# Altium schematic sheet top_overview.SchDoc
size B; SheetNumber: 1; SheetTotal: 3
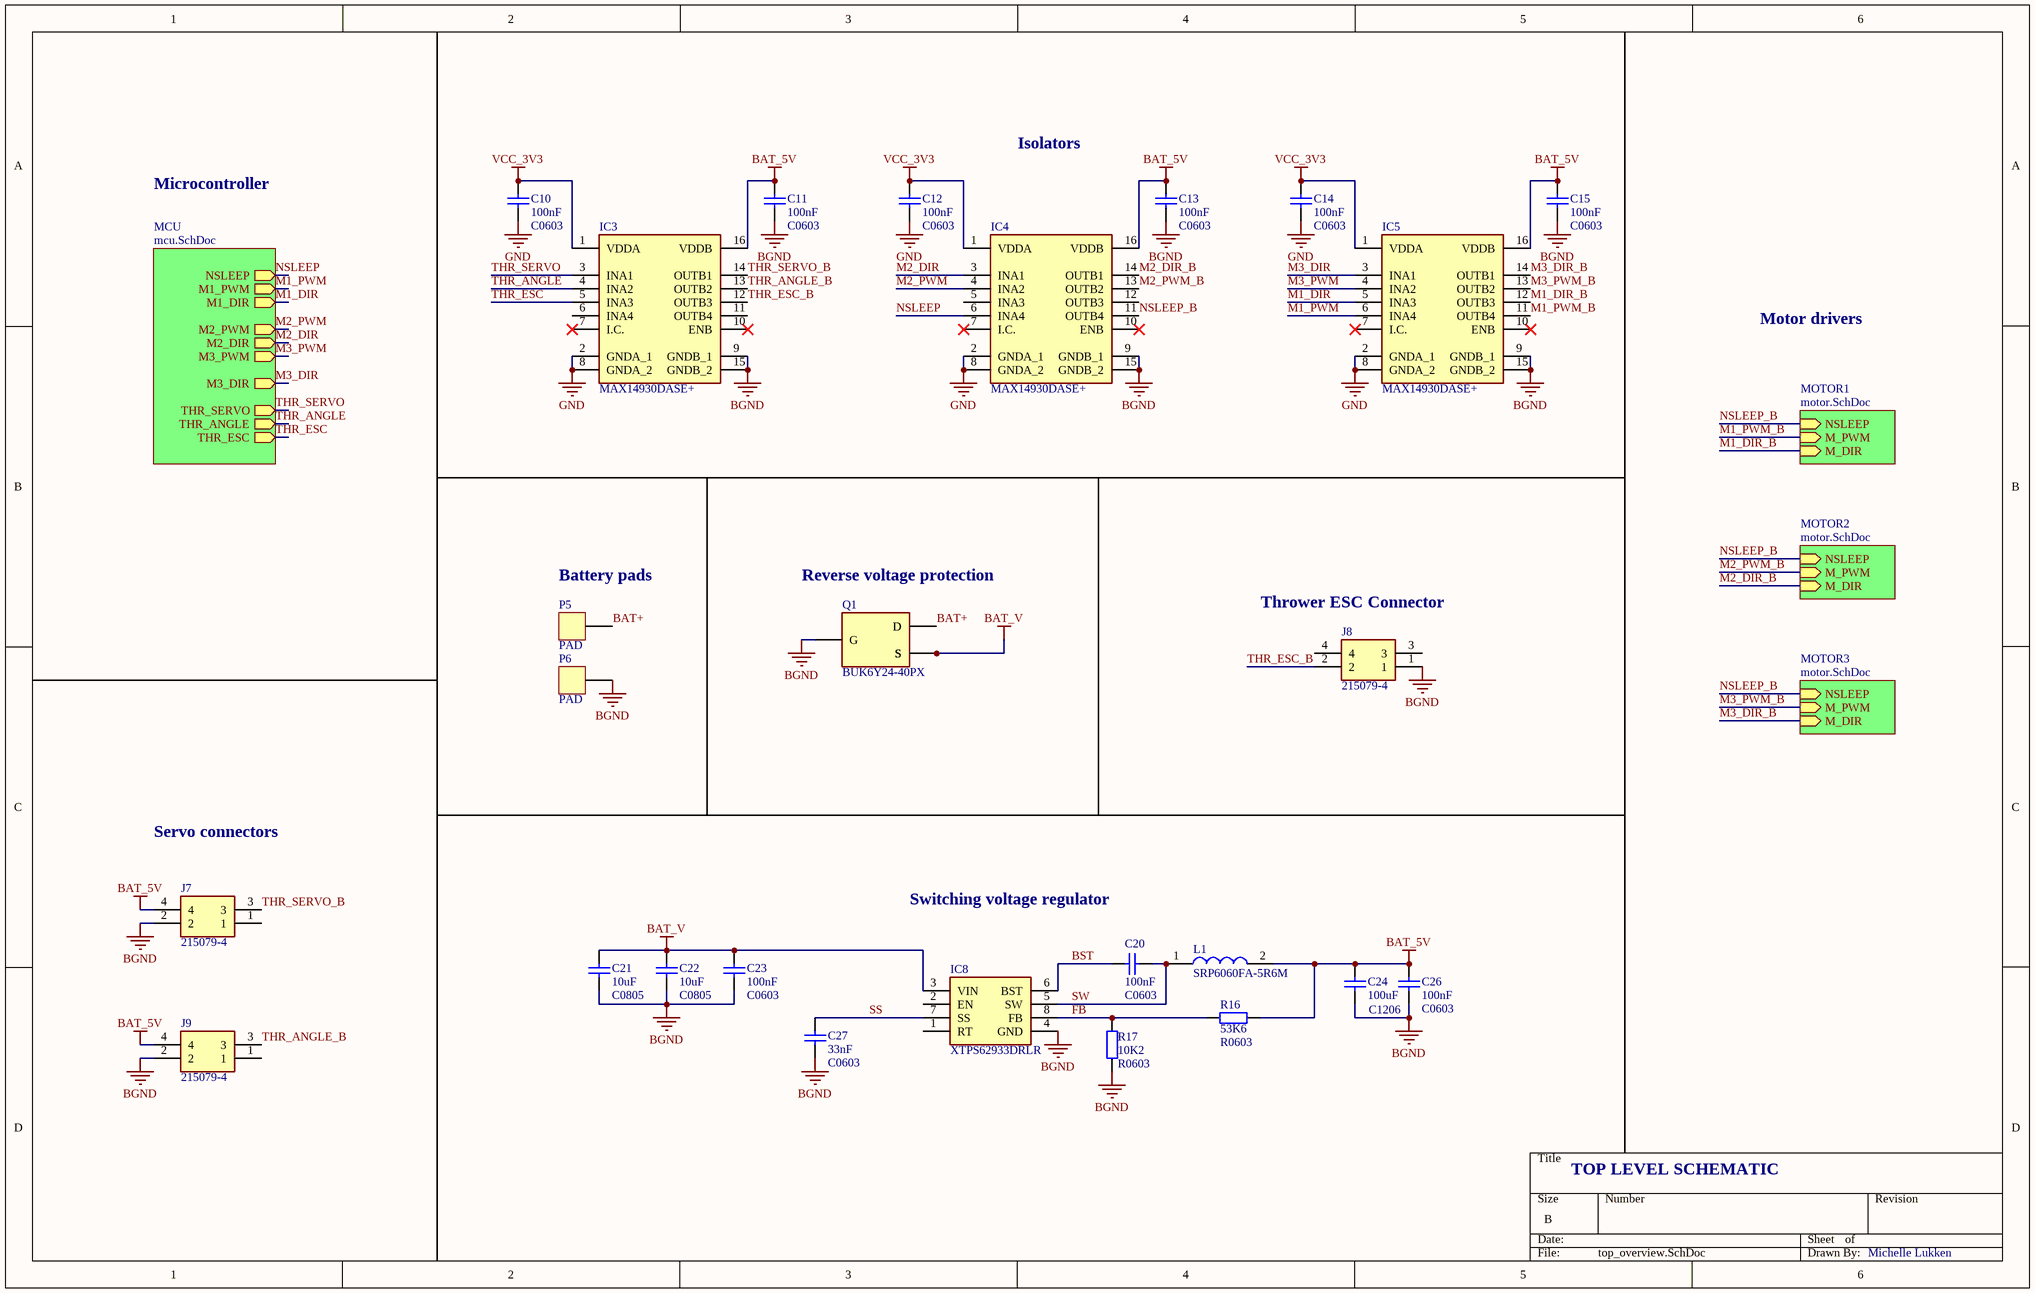
[diagram p0: top_overview.SchDoc]

## Parts
C10  Capacitance: 100nF  [C0603]
C11  Capacitance: 100nF  [C0603]
C12  Capacitance: 100nF  [C0603]
C13  Capacitance: 100nF  [C0603]
C14  Capacitance: 100nF  [C0603]
C15  Capacitance: 100nF  [C0603]
C20  Capacitance: 100nF  [C0603]
C21  Capacitance: 10uF  [C0805]
C22  Capacitance: 10uF  [C0805]
C23  Capacitance: 100nF  [C0603]
C24  Capacitance: 100uF  [C1206]
C26  Capacitance: 100nF  [C0603]
C27  Capacitance: 33nF  [C0603]
IC3  MAX14930DASE+  [SOIC127P600X175-16N]
IC4  MAX14930DASE+  [SOIC127P600X175-16N]
IC5  MAX14930DASE+  [SOIC127P600X175-16N]
IC8  XTPS62933DRLR  [SOTFL50P160X60-8N]
J7  215079-4  [2150794]
J8  215079-4  [2150794]
J9  215079-4  [2150794]
L1  SRP6060FA-5R6M  [SRP6060FA5R6M]
P5  PAD  [BIG_PAD]
P6  PAD  [BIG_PAD]
Q1  BUK6Y24-40PX  [BUK6Y2440PX]
R16  53K6  [R0603]
R17  10K2  [R0603]

## Sub-sheets
MCU = mcu.SchDoc: M2_DIR (out), M3_PWM (out), M1_PWM (out), M2_PWM (out), M3_DIR (out), M1_DIR (out), NSLEEP (out), THR_SERVO (out), THR_ANGLE (out), THR_ESC (out)
MOTOR1 = motor.SchDoc: NSLEEP (in), M_PWM (in), M_DIR (in)
MOTOR2 = motor.SchDoc: NSLEEP (in), M_PWM (in), M_DIR (in)
MOTOR3 = motor.SchDoc: NSLEEP (in), M_PWM (in), M_DIR (in)

## Nets
BAT_5V: C11.2 C13.2 C15.2 C24.1 C26.1 IC3.16(VDDB) IC4.16(VDDB) IC5.16(VDDB) J7.4 J9.4 L1.2 R16.2
BAT_V: C21.2 C22.2 C23.2 IC8.3(VIN) Q1.1(S) Q1.2(S) Q1.3(S)
BGND: C11.1 C13.1 C15.1 C21.1 C22.1 C23.1 C24.2 C26.2 C27.1 IC3.9(GNDB_1) IC3.15(GNDB_2) IC4.9(GNDB_1) IC4.15(GNDB_2) IC5.9(GNDB_1) IC5.15(GNDB_2) IC8.4(GND) J7.2 J8.1 J9.2 P6.1(PAD) Q1.4(G) R17.2
GND: C10.1 C12.1 C14.1 IC3.2(GNDA_1) IC3.8(GNDA_2) IC4.2(GNDA_1) IC4.8(GNDA_2) IC5.2(GNDA_1) IC5.8(GNDA_2)
VCC_3V3: C10.2 C12.2 C14.2 IC3.1(VDDA) IC4.1(VDDA) IC5.1(VDDA)
BAT+: P5.1(PAD) Q1.5(D) Q1.6(D)
BST: C20.2 IC8.6(BST)
FB: IC8.8(FB) R16.1 R17.1
M1_DIR: IC5.5(INA3) ; sheet MCU/M1_DIR
M1_DIR_B: IC5.12(OUTB3) ; sheet MOTOR1/M_DIR
M1_PWM: IC5.6(INA4) ; sheet MCU/M1_PWM
M1_PWM_B: IC5.11(OUTB4) ; sheet MOTOR1/M_PWM
M2_DIR: IC4.3(INA1) ; sheet MCU/M2_DIR
M2_DIR_B: IC4.14(OUTB1) ; sheet MOTOR2/M_DIR
M2_PWM: IC4.4(INA2) ; sheet MCU/M2_PWM
M2_PWM_B: IC4.13(OUTB2) ; sheet MOTOR2/M_PWM
M3_DIR: IC5.3(INA1) ; sheet MCU/M3_DIR
M3_DIR_B: IC5.14(OUTB1) ; sheet MOTOR3/M_DIR
M3_PWM: IC5.4(INA2) ; sheet MCU/M3_PWM
M3_PWM_B: IC5.13(OUTB2) ; sheet MOTOR3/M_PWM
NSLEEP: IC4.6(INA4) ; sheet MCU/NSLEEP
NSLEEP_B: IC4.11(OUTB4) ; sheet MOTOR1/NSLEEP, sheet MOTOR2/NSLEEP, sheet MOTOR3/NSLEEP
SS: C27.2 IC8.7(SS)
SW: C20.1 IC8.5(SW) L1.1
THR_ANGLE: IC3.4(INA2) ; sheet MCU/THR_ANGLE
THR_ANGLE_B: IC3.13(OUTB2) J9.3
THR_ESC: IC3.5(INA3) ; sheet MCU/THR_ESC
THR_ESC_B: IC3.12(OUTB3) J8.2
THR_SERVO: IC3.3(INA1) ; sheet MCU/THR_SERVO
THR_SERVO_B: IC3.14(OUTB1) J7.3

Not connected (* = marked no-connect by the designer): IC3 6(INA4) 7(I.C.)* 10(ENB)* 11(OUTB4); IC4 5(INA3) 7(I.C.)* 10(ENB)* 12(OUTB3); IC5 7(I.C.)* 10(ENB)*; IC8 1(RT) 2(EN); J7 1; J8 3 4; J9 1

## Notes on the sheet
- Isolators
- Microcontroller
- Motor drivers
- (near P5) Battery pads
- (near Q1) Reverse voltage protection
- (near J8) Thrower ESC Connector
- Servo connectors
- Switching voltage regulator
- TOP LEVEL SCHEMATIC
- Michelle Lukken

## Library data of the parts
C10-C15 C20-C24 C26 C27 = Capacitor: Ceramic capacitor; Type: MLCC; Voltage rating: *V; ComponentLinknDescription: Datasheet; Characteristic: *; Manufacturer: *; ComponentLinknURL: *
  C10-C15 C20 C23 C26 C27: Note: C0603
  C21 C22: Note: C0805
  C24: Note: C1206
IC3-IC5 = MAX14930DASE+: Integrated Circuit; Manufacturer_Name: Maxim Integrated; Manufacturer_Part_Number: MAX14930EASE+; Datasheet Link: https://datasheets.maximintegrated.com/en/ds/MAX14130-MAX14932.pdf; Height: 1.75mm; Mouser Part Number: 700-MAX14930EASE+; Mouser Price/Stock: https://www.mouser.co.uk/ProductDetail/Maxim-Integrated/MAX14930EASE%2b?qs=AAveGqk956E0OaZbIR%2FI4w%3D%3D
IC8 = XTPS62933DRLR: Integrated Circuit; Manufacturer_Name: Texas Instruments; Datasheet Link: https://www.ti.com/lit/ds/symlink/tps62933.pdf?ts=1626073394234; Height: 0.6mm; Manufacturer_Part_Number: TPS62933DRLR; Mouser Part Number: 595-TPS62933DRLR; Mouser Price/Stock: https://www.mouser.co.uk/ProductDetail/Texas-Instruments/TPS62933DRLR?qs=Rp5uXu7WBW9fv47wfQVntQ%3D%3D; Arrow Part Number: TPS62933DRLR; Arrow Price/Stock: https://www.arrow.com/en/products/tps62933drlr/texas-instruments?region=nac
J7-J9 = 215079-4: Connector; Manufacturer_Name: TE Connectivity; Datasheet Link: https://www.te.com/commerce/DocumentDelivery/DDEController?Action=srchrtrv&DocNm=215079&DocType=Customer+Drawing&DocLang=English; Height: 4.2mm; Manufacturer_Part_Number: 215079-4; Mouser Part Number: 571-215079-4; Mouser Price/Stock: https://www.mouser.co.uk/ProductDetail/TE-Connectivity/215079-4?qs=O3N86PA0UL%252BdoZEVcFx8sQ%3D%3D; Arrow Part Number: 215079-4; Arrow Price/Stock: https://www.arrow.com/en/products/215079-4/te-connectivity
L1 = SRP6060FA-5R6M: Inductor; Manufacturer_Name: Bourns; Datasheet Link: https://www.bourns.com/docs/Product-Datasheets/SRP6060FA.pdf; Height: 6mm; Manufacturer_Part_Number: SRP6060FA-5R6M; Mouser Part Number: 652-SRP6060FA-5R6M; Mouser Price/Stock: https://www.mouser.co.uk/ProductDetail/Bourns/SRP6060FA-5R6M?qs=MLItCLRbWsxLUQxbwaGgMA%3D%3D; Arrow Part Number: SRP6060FA-5R6M; Arrow Price/Stock: https://www.arrow.com/en/products/srp6060fa-5r6m/bourns?region=nac
Q1 = BUK6Y24-40PX: MOSFET (P-Channel); Manufacturer_Name: Nexperia; Datasheet Link: https://assets.nexperia.com/documents/data-sheet/BUK6Y24-40P.pdf; Height: 1.2mm; Manufacturer_Part_Number: BUK6Y24-40PX; Mouser Part Number: 771-BUK6Y24-40PX; Mouser Price/Stock: https://www.mouser.co.uk/ProductDetail/Nexperia/BUK6Y24-40PX?qs=vmHwEFxEFR8tyd2WwTEwBg%3D%3D; Arrow Part Number: BUK6Y24-40PX; Arrow Price/Stock: https://www.arrow.com/en/products/buk6y24-40px/nexperia?region=nac
R16 R17 = Resistor: Precision: *%; Voltage rating: *V; Temp coefficient: *ppm; Power rating: *mW; ComponentLinknDescription: Datasheet; Manufacturer: *; ComponentLinknURL: *; Note: R0603
  R16: Resistance: 53K6
  R17: Resistance: 10K2